# EAGLE board VCAMatrixBottom (EAGLE 9.4.0), part 1 of 2
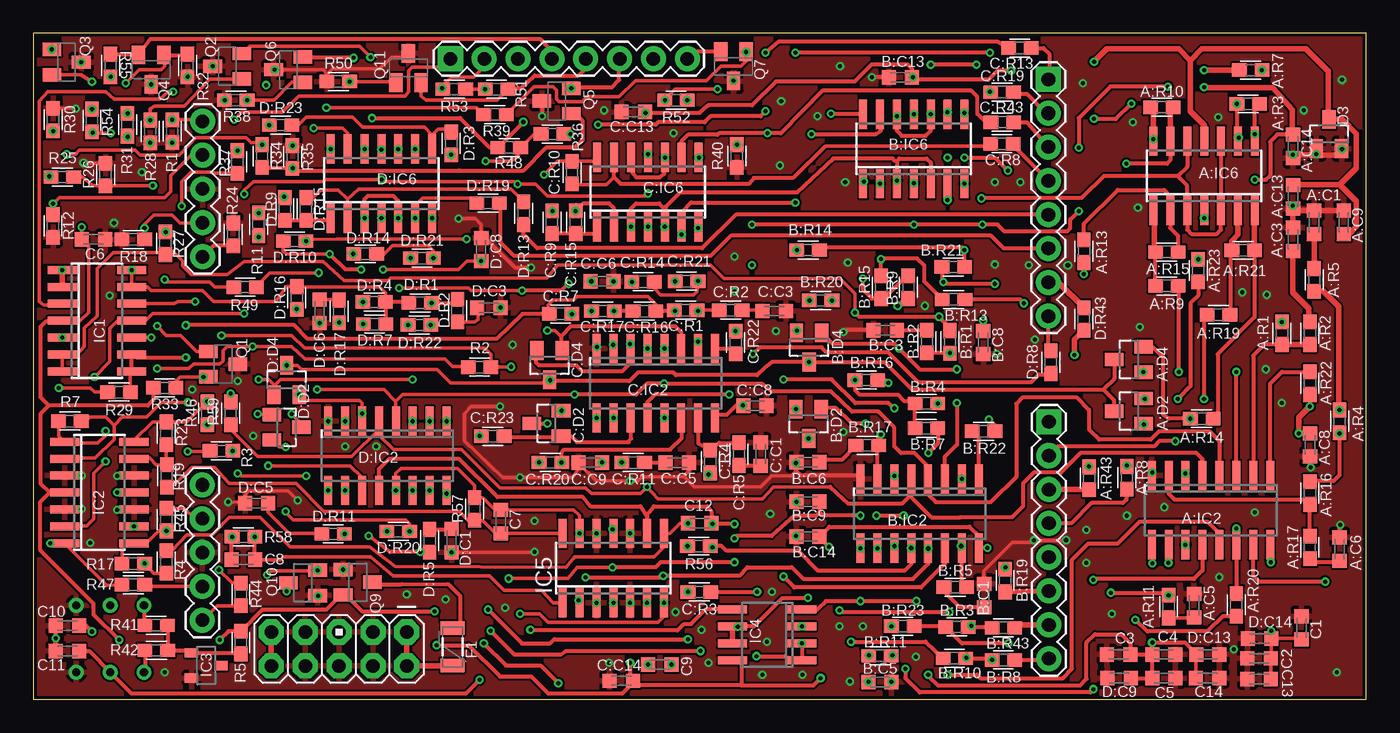
[diagram p2: board, top side]
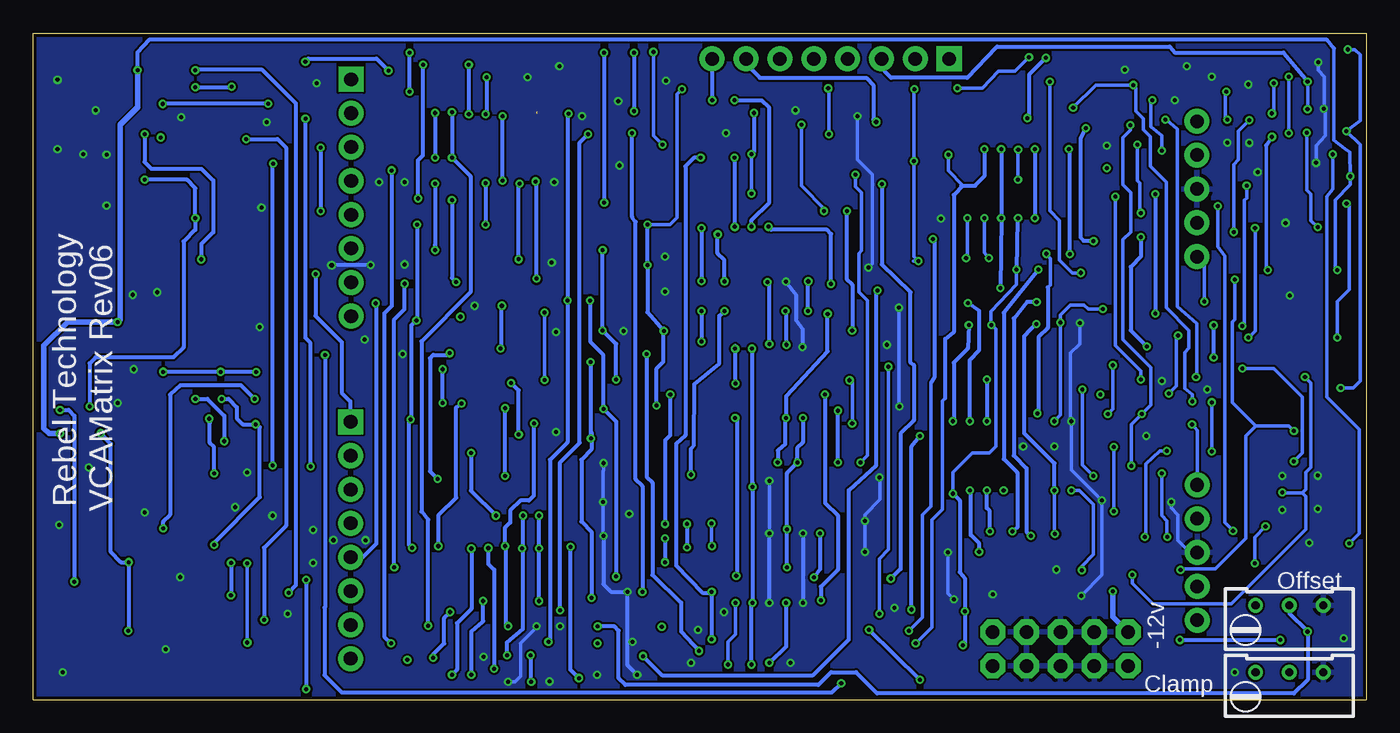
[diagram p3: board, bottom side, seen from below]

Size 100 x 50 mm. Coordinates in mm from the lower left corner, seen from the top.
Outline: 100,0 100,50 0,50 0,0 100,0
Copper layers (1*16): Top 0.035mm / dielectric 1.5mm / Bottom 0.035mm
Design rules "SeeedStudio_2layer_DRU_no_angle_20140221": minimum track width 6mil, minimum drill 12mil, track to track 6mil, track to pad 6mil, pad to pad 6mil, via to via 6mil, smd to smd 0mil, copper to edge 10mil, drill to drill 10mil, minimum pad ring 10mil, minimum via ring 6mil, stop-mask expansion 2mil, vias tented up to drill 100mil, thermal gap 10mil

## Footprints (pad centres in the part's own frame; a part is rotated, then mirrored left to right if it is on the bottom)
C0603K = smd 1.05 x 1.08: 1 -0.875,0; 2 0.875,0
SOT23 = smd 1 x 1.4: 1 -0.95,-1.1; 2 0.95,-1.1; 3 0,1.1
SOIC16N = smd 0.6 x 2.2: 1 -4.445,-2.6; 2 -3.175,-2.6; 3 -1.905,-2.6; 4 -0.635,-2.6; 5 0.635,-2.6; 6 1.905,-2.6; 7 3.175,-2.6; 8 4.445,-2.6; 9 4.445,2.6; 10 3.175,2.6; 11 1.905,2.6; 12 0.635,2.6; 13 -0.635,2.6; 14 -1.905,2.6; 15 -3.175,2.6; 16 -4.445,2.6
SO14 = smd 0.6 x 2.2: 1 -3.81,-2.6; 2 -2.54,-2.6; 3 -1.27,-2.6; 4 0,-2.6; 5 1.27,-2.6; 6 2.54,-2.6; 7 3.81,-2.6; 8 3.81,2.6; 9 2.54,2.6; 10 1.27,2.6; 11 0,2.6; 12 -1.27,2.6; 13 -2.54,2.6; 14 -3.81,2.6
0603 = smd 1.1 x 1: 1 -0.85,0; 2 0.85,0
RTRIM64W = drill 0.61: 1 1.27,-2.54; 2 1.27,0; 3 1.27,2.54
PTC-1206 = smd 1 x 1.8: 1 -1.4,0; 2 1.4,0
DBZ_R-PDSO-G3 = smd 0.7 x 1: 1 -0.95,-1.1; 2 0.95,-1.1; 3 0,1.1
SO08 = smd 0.6 x 2.2: 1 -1.905,-2.6; 2 -0.635,-2.6; 3 0.635,-2.6; 4 1.905,-2.6; 5 1.905,2.6; 6 0.635,2.6; 7 -0.635,2.6; 8 -1.905,2.6
1X05 = drill 1.016 pad 1.88: 1 0,0; 2 2.54,0; 3 5.08,0; 4 7.62,0; 5 10.16,0
1X08 = drill 1.016 pad 1.88 square: 1 0,0 | drill 1.016 pad 1.88: 2 2.54,0; 3 5.08,0; 4 7.62,0; 5 10.16,0; 6 12.7,0; 7 15.24,0; 8 17.78,0
AVR_ICSP = drill 1.016 pad 1.88 octagon: 1 -1.27,5.08; 2 1.27,5.08; 3 -1.27,2.54; 4 1.27,2.54; 5 -1.27,0; 6 1.27,0; 7 -1.27,-2.54; 8 1.27,-2.54; 9 -1.27,-5.08; 10 1.27,-5.08
SOT23-BEC = smd 1 x 1.4: B -0.95,-1.1; C 0,1.1; E 0.95,-1.1

## Placement (x,y rotation side)
A:C1  560p  [C0603K]  96.1,35.81 90 top
A:C3  560p  [C0603K]  94.51,34.54 90 top
A:C5  560p  [C0603K]  87.08,7.04 90 top
A:C6  560p  [C0603K]  98,11.3 90 top
A:C8  100n  [C0603K]  95.78,19.11 270 top
A:C9  100n  [C0603K]  98.32,35.81 270 top
A:C13  100n  [C0603K]  94.51,37.71 270 top
A:C14  100n  [C0603K]  94.51,41.52 270 top
A:D2  BAT54A  [SOT23]  82.19,21.65 90 top
A:D4  BAT54A  [SOT23]  82.19,25.52 90 top
A:IC2  SSM2164S  [SOIC16N]  88.35,14.22 180 top
A:IC6  QUAD_OPAMPD  [SO14]  87.84,39.3 0 top
A:R1  30k  [0603]  93.68,27.49 270 top
A:R2  510R  [0603]  95.78,27.49 270 top
A:R3  68k  [0603]  91.14,44.7 180 top
A:R4  30k  [0603]  98,20.89 90 top
A:R5  510R  [0603]  96.1,31.49 270 top
A:R7  30k  [0603]  91.33,47.24 180 top
A:R8  100k  [0603]  82.04,16.65 270 top
A:R9  510R  [0603]  85.05,31.05 0 top
A:R10  68k  [0603]  84.67,44.44 0 top
A:R11  510R  [0603]  85.18,6.98 90 top
A:R13  100k  [0603]  78.82,33.64 270 top
A:R14  510R  [0603]  87.65,21.08 180 top
A:R15  68k  [0603]  85.05,33.59 0 top
A:R16  30k  [0603]  95.78,15.49 270 top
A:R17  510R  [0603]  95.78,11.42 90 top
A:R19  100k  [0603]  88.92,28.89 180 top
A:R20  510R  [0603]  90.26,7.11 90 top
A:R21  68k  [0603]  90.76,33.71 180 top
A:R22  5k1  [0603]  95.78,23.74 270 top
A:R23  510R  [0603]  87.4,32.19 90 top
A:R43  100k  [0603]  79.22,16.61 270 top
B:C1  560p  [C0603K]  71.33,7.79 90 top
B:C3  560p  [C0603K]  63.92,27.72 180 top
B:C5  560p  [C0603K]  63.52,1.32 0 top
B:C6  560p  [C0603K]  58.12,17.8 180 top
B:C8  100n  [C0603K]  71.26,26.8 270 top
B:C9  100n  [C0603K]  58.12,14.84 0 top
B:C13  100n  [C0603K]  65.05,46.69 180 top
B:C14  100n  [C0603K]  58.12,12.24 180 top
B:D2  BAT54A  [SOT23]  58.17,20.69 180 top
B:D4  BAT54A  [SOT23]  58.2,26.43 180 top
B:IC2  SSM2164S  [SOIC16N]  66.5,13.95 180 top
B:IC6  QUAD_OPAMPD  [SO14]  66.06,41.32 0 top
B:R1  30k  [0603]  68.76,26.84 270 top
B:R2  510R  [0603]  67.04,26.86 270 top
B:R3  68k  [0603]  69.29,5.44 0 top
B:R4  30k  [0603]  67.01,22.22 0 top
B:R5  510R  [0603]  69.17,8.43 0 top
B:R7  30k  [0603]  67.01,20.36 0 top
B:R8  100k  [0603]  72.79,2.97 0 top
B:R9  510R  [0603]  65.65,30.94 270 top
B:R10  68k  [0603]  69.1,3.1 0 top
B:R11  510R  [0603]  63.52,3.29 0 top
B:R13  100k  [0603]  69.04,30.02 0 top
B:R14  510R  [0603]  58.13,33.74 180 top
B:R15  68k  [0603]  63.62,30.94 90 top
B:R16  30k  [0603]  62.5,23.97 0 top
B:R17  510R  [0603]  62.56,19.07 0 top
B:R19  100k  [0603]  72.91,8.94 270 top
B:R20  510R  [0603]  59.07,29.96 180 top
B:R21  68k  [0603]  69.02,32.47 180 top
B:R22  5k1  [0603]  71.29,20.13 0 top
B:R23  510R  [0603]  65.23,5.51 0 top
B:R43  100k  [0603]  72.79,5.38 0 top
C1  100n  [C0603K]  95.14,5.38 90 top
C2  100n  [C0603K]  91.96,3.1 180 top
C3  100n  [C0603K]  81.42,3.39 180 top
C4  100n  [C0603K]  84.82,3.39 0 top
C5  100n  [C0603K]  84.82,1.61 0 top
C6  100n  [C0603K]  4.52,34.53 0 top
C7  100p  [C0603K]  35.07,13.36 90 top
C8  100p  [C0603K]  15.77,10.5 180 top
C9  100p  [C0603K]  47.01,2.62 180 top
C10  4u7  [C0603K]  2.56,5.55 180 top
C11  4u7  [C0603K]  2.56,3.64 180 top
C12  100p  [C0603K]  49.99,13.23 0 top
C13  100n  [C0603K]  91.97,1.54 180 top
C14  100n  [C0603K]  88.09,1.61 0 top
C:C1  560p  [C0603K]  54.58,18.41 90 top
C:C3  560p  [C0603K]  55.58,29.15 0 top
C:C5  560p  [C0603K]  48.32,17.78 0 top
C:C6  560p  [C0603K]  42.66,31.38 0 top
C:C8  100n  [C0603K]  54.14,22.06 0 top
C:C9  100n  [C0603K]  41.79,17.79 0 top
C:C13  100n  [C0603K]  45.01,44.09 180 top
C:C14  100n  [C0603K]  44.12,1.41 180 top
C:D2  BAT54A  [SOT23]  38.5,20.72 90 top
C:D4  BAT54A  [SOT23]  38.73,25.09 180 top
C:IC2  SSM2164S  [SOIC16N]  46.71,23.73 180 top
C:IC6  QUAD_OPAMPD  [SO14]  46.11,38.08 0 top
C:R1  30k  [0603]  48.95,29.22 0 top
C:R2  510R  [0603]  52.31,29.22 180 top
C:R3  68k  [0603]  49.97,8.07 0 top
C:R4  30k  [0603]  50.79,17.85 90 top
C:R5  510R  [0603]  52.95,18.42 90 top
C:R7  30k  [0603]  39.55,28.95 0 top
C:R8  100k  [0603]  72.67,41.7 0 top
C:R9  510R  [0603]  38.92,35.82 90 top
C:R10  68k  [0603]  40.41,39.55 270 top
C:R11  510R  [0603]  45.01,17.79 180 top
C:R13  100k  [0603]  74.02,48.89 0 top
C:R14  510R  [0603]  45.75,31.36 180 top
C:R15  68k  [0603]  40.69,35.82 90 top
C:R16  30k  [0603]  45.84,29.15 180 top
C:R17  510R  [0603]  42.73,29.15 0 top
C:R19  100k  [0603]  72.68,45.59 0 top
C:R20  510R  [0603]  38.79,17.79 0 top
C:R21  68k  [0603]  49.01,31.39 180 top
C:R22  5k1  [0603]  52.7,26.8 90 top
C:R23  510R  [0603]  34.47,19.76 180 top
C:R43  100k  [0603]  72.69,43.32 0 top
CLAMP  10k lin  [RTRIM64W]  5.76,0.78 90 bottom
D3  BAT54A  [SOT23]  97.21,42.44 0 top
D:C1  560p  [C0603K]  31.38,11.92 270 top
D:C3  560p  [C0603K]  34.17,29.4 0 top
D:C5  560p  [C0603K]  16.75,14.74 180 top
D:C6  560p  [C0603K]  21.48,29.13 270 top
D:C8  100n  [C0603K]  33.6,33.77 90 top
D:C9  100n  [C0603K]  81.46,1.61 0 top
D:C13  100n  [C0603K]  88.12,3.39 0 top
D:C14  100n  [C0603K]  92,4.58 180 top
D:D2  BAT54A  [SOT23]  19,20.43 270 top
D:D4  BAT54A  [SOT23]  19,23.99 0 top
D:IC2  SSM2164S  [SOIC16N]  26.57,18.29 180 top
D:IC6  QUAD_OPAMPD  [SO14]  26.11,38.72 0 top
D:R1  30k  [0603]  29.04,29.77 0 top
D:R2  510R  [0603]  31.83,29.19 90 top
D:R3  68k  [0603]  31.35,41.73 270 top
D:R4  30k  [0603]  25.57,29.84 180 top
D:R5  510R  [0603]  29.73,11.92 270 top
D:R7  30k  [0603]  25.61,28.18 180 top
D:R8  100k  [0603]  76.34,25.32 90 top
D:R9  510R  [0603]  18.88,36.81 90 top
D:R10  68k  [0603]  19.6,34.41 0 top
D:R11  510R  [0603]  22.49,12.43 0 top
D:R13  100k  [0603]  36.78,36.5 270 top
D:R14  510R  [0603]  24.91,33.45 180 top
D:R15  68k  [0603]  20.46,36.81 90 top
D:R16  30k  [0603]  19.76,30.15 270 top
D:R17  510R  [0603]  22.94,29.13 270 top
D:R19  100k  [0603]  34.12,37.26 0 top
D:R20  510R  [0603]  27.38,12.62 0 top
D:R21  68k  [0603]  29.16,33.13 180 top
D:R22  5k1  [0603]  28.97,28.11 180 top
D:R23  510R  [0603]  18.56,43.1 0 top
D:R43  100k  [0603]  78.82,28.56 90 top
F1  PTCSMD  [PTC-1206]  31.45,3.96 90 top
IC1  QUAD_OPAMPD  [SO14]  4.78,28.43 270 top
IC2  QUAD_OPAMPD  [SO14]  4.95,15.53 270 top
IC3  LM4040B10  [DBZ_R-PDSO-G3]  12.97,2.56 270 top
IC4  TL072D  [SO08]  55.05,4.85 90 top
IC5  QUAD_OPAMPD  [SO14]  43.52,9.86 0 top
J3  [1X05]  12.7,33.24 90 top
J4  [1X05]  12.68,16.11 270 top
JP1  [1X08]  76.19,20.84 270 top
JP3  [1X08]  76.16,46.55 270 top
JP5  [1X08]  31.29,48.09 0 top
JP8  M05X2PTH  [AVR_ICSP]  22.94,3.79 270 top
OFFSET  10k lin  [RTRIM64W]  5.76,5.79 90 bottom
Q1  BC856ALT1SMD  [SOT23-BEC]  14.24,25.17 270 top
Q2  BC856ALT1SMD  [SOT23-BEC]  14.56,47.52 90 top
Q3  BC856ALT1SMD  [SOT23-BEC]  2.49,47.84 270 top
Q4  BC856ALT1SMD  [SOT23-BEC]  8.84,47.26 180 top
Q5  BC856ALT1SMD  [SOT23-BEC]  39.26,44.92 90 top
Q6  BC856ALT1SMD  [SOT23-BEC]  19.13,47.26 90 top
Q7  BC856ALT1SMD  [SOT23-BEC]  52.53,47.52 180 top
Q9  BSS84  [SOT23]  24.34,8.8 270 top
Q10  BSS123  [SOT23]  20.23,8.76 90 top
Q11  BC856ALT1SMD  [SOT23-BEC]  28.15,47.39 0 top
R1  100k  [0603]  10.43,42.66 90 top
R2  10k  [0603]  33.48,24.94 180 top
R3  10k  [0603]  14.12,18.66 180 top
R4  10k  [0603]  9.99,10.33 270 top
R5  510R  [0603]  15.58,4.28 90 top
R7  10k  [0603]  2.75,20.9 180 top
R11  10k  [0603]  16.91,35.67 90 top
R12  100k  [0603]  1.48,35.54 90 top
R17  10k  [0603]  7.51,10.21 180 top
R18  100k  [0603]  7.51,34.53 0 top
R19  10k  [0603]  10.01,16.79 90 top
R23  10k  [0603]  9.99,19.99 90 top
R24  100k  [0603]  15,34.91 270 top
R25  100k  [0603]  2.18,39.2 0 top
R26  100k  [0603]  5.41,39.39 270 top
R27  100k  [0603]  9.92,34.25 90 top
R28  100k  [0603]  8.78,42.63 90 top
R29  100k  [0603]  6.43,23.07 180 top
R30  100k  [0603]  1.48,43.52 270 top
R31  100k  [0603]  7.07,43.14 90 top
R32  100k  [0603]  11.57,47.58 90 top
R33  2k7  [0603]  9.86,23.39 180 top
R34  100k  [0603]  17.16,40.79 270 top
R35  100k  [0603]  19.45,40.72 270 top
R36  2k7  [0603]  38.94,42.44 180 top
R37  100k  [0603]  15.32,40.34 90 top
R38  100k  [0603]  15.19,44.98 0 top
R39  100k  [0603]  34.62,43.9 0 top
R40  100k  [0603]  52.79,40.79 90 top
R41  10k  [0603]  9.22,5.57 0 top
R42  100k  [0603]  9.23,3.69 0 top
R44  1k  [0603]  15.58,7.9 90 top
R45  1k  [0603]  9.99,13.51 270 top
R46  1k  [0603]  13.06,21.49 90 top
R47  1k  [0603]  7.51,8.62 180 top
R48  2k7  [0603]  35.7,41.42 0 top
R49  100k  [0603]  15.89,30.95 0 top
R50  100k  [0603]  22.88,46.38 0 top
R51  2k7  [0603]  34.75,45.8 180 top
R52  2k7  [0603]  48.21,44.98 180 top
R53  2k7  [0603]  31.58,45.8 0 top
R54  2k7  [0603]  4.4,43.45 270 top
R55  2k7  [0603]  5.8,47.58 270 top
R56  30k  [0603]  49.93,11.51 180 top
R57  30k  [0603]  33.1,14.31 270 top
R58  30k  [0603]  15.77,12.21 0 top
R59  30k  [0603]  14.81,21.48 90 top